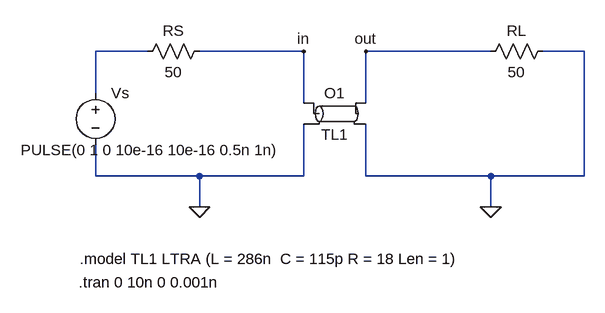
[diagram p0: schematic exercise2_lossyTL.asc]
exercise2_lossyTL.asc, the LTspice schematic file:
Version 4
SHEET 1 880 680
WIRE -48 0 -128 0
WIRE 192 0 32 0
WIRE 480 0 288 0
WIRE 624 0 560 0
WIRE -128 64 -128 0
WIRE 192 80 192 0
WIRE 288 80 288 0
WIRE -128 192 -128 144
WIRE 32 192 -128 192
WIRE 192 192 192 112
WIRE 192 192 32 192
WIRE 288 192 288 112
WIRE 480 192 288 192
WIRE 624 192 624 0
WIRE 624 192 480 192
WIRE 32 240 32 192
WIRE 480 240 480 192
FLAG 480 240 0
FLAG 32 240 0
FLAG 288 0 out
FLAG 192 0 in
SYMBOL ltline 240 96 R0
SYMATTR InstName O1
SYMATTR Value TL1
SYMBOL res 576 -16 R90
WINDOW 0 0 56 VBottom 2
WINDOW 3 32 56 VTop 2
SYMATTR InstName RL
SYMATTR Value 50
SYMBOL res 48 -16 R90
WINDOW 0 0 56 VBottom 2
WINDOW 3 32 56 VTop 2
SYMATTR InstName RS
SYMATTR Value 50
SYMBOL voltage -128 48 R0
WINDOW 3 -115 104 Left 2
WINDOW 123 0 0 Left 0
WINDOW 39 0 0 Left 0
SYMATTR InstName Vs
SYMATTR Value PULSE(0 1 0 10e-16 10e-16 0.5n 1n)
TEXT -152 320 Left 2 !.model TL1 LTRA (L = 286n  C = 115p R = 18 Len = 1)
TEXT -154 356 Left 2 !.tran 0 10n 0 0.001n

The netlist it stands for:
* exercise2_lossyTL.asc
O1 in 0 out 0 TL1
RL 0 out 50
RS in N001 50
Vs N001 0 PULSE(0 1 0 10e-16 10e-16 0.5n 1n)
.model TL1 LTRA (L = 286n  C = 115p R = 18 Len = 1)
.tran 0 10n 0 0.001n
.backanno
.end